# Altium project 省电V1.0.PrjPCB
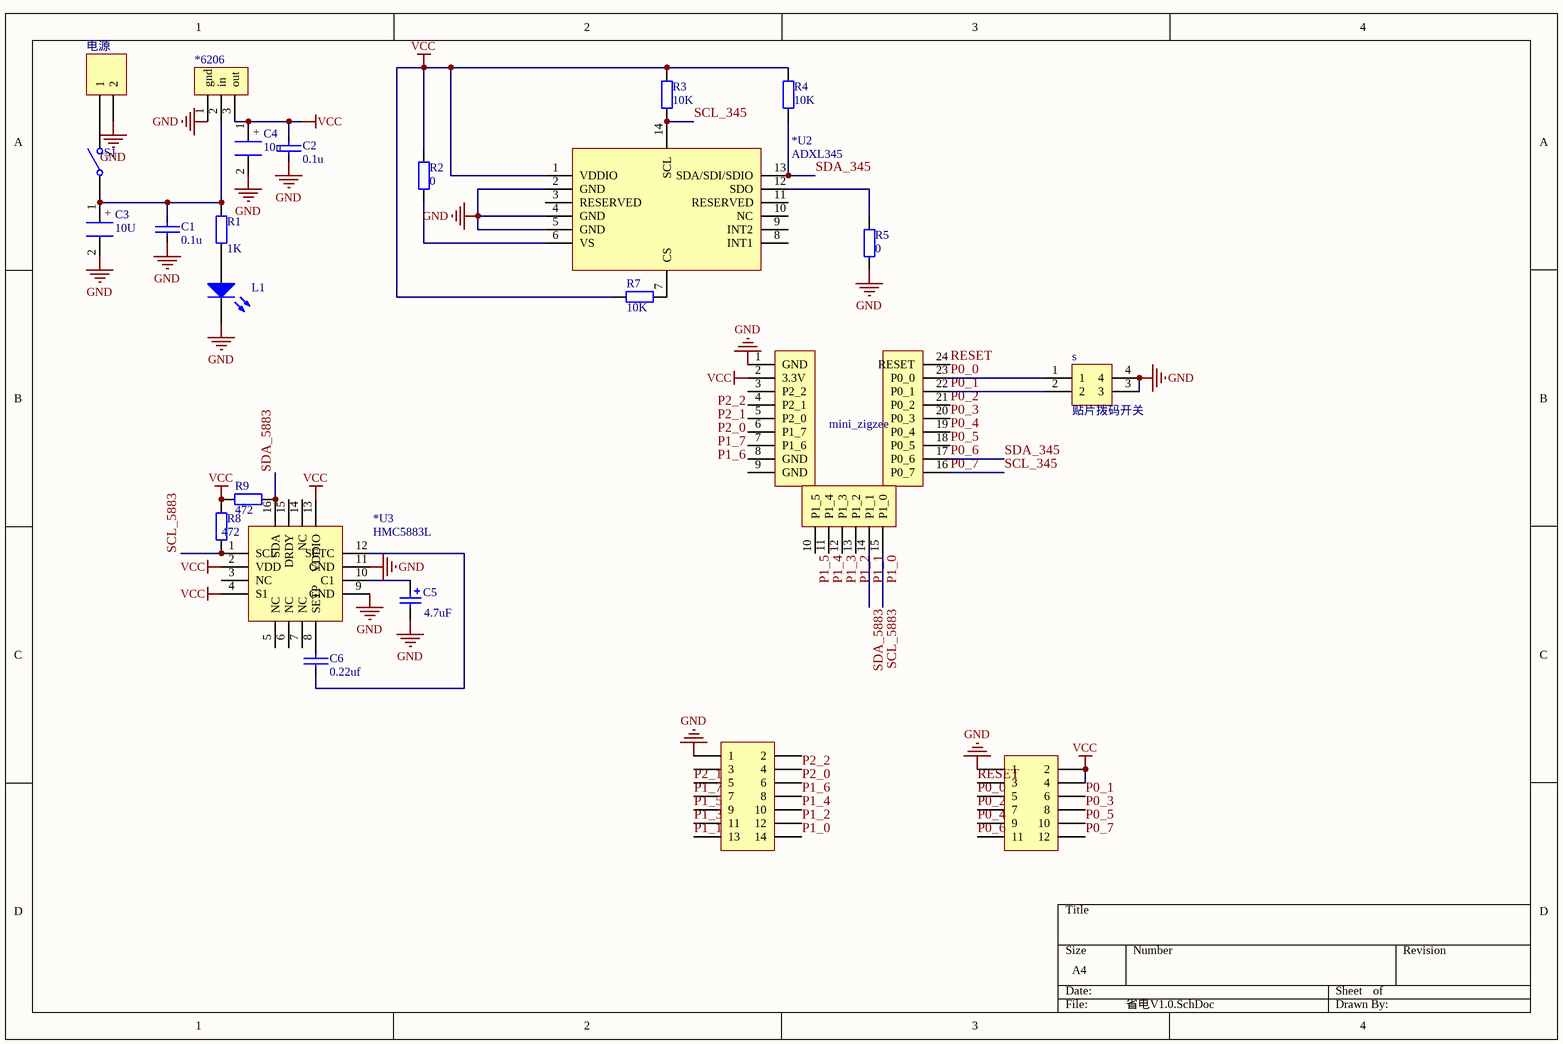
[diagram p0: 省电V1.0.SchDoc]
1 sheet, 24 parts. Net scope: global (net labels, ports and power ports of the same name join across sheets).
Board file: 省电v1.0.PcbDoc

## Sheet 省电V1.0.SchDoc
size A4

### Parts
*U1  *6206  [SOT89/X.7]
*U2  ADXL345  [ADXL345]
*U3  HMC5883L  [HMC5883L]
*U4  mini_zigzee  [mini_zigbee]
C1  0.1u  [0603]
C2  0.1u  [0603]
C3  10U  [1206]
C4  10u  [1206]
C5  value 4.7uF  [0603]  (hidden comment: Cap Pol2)
C6  0.22uf  [0603]
JP2  Header 2X7  [HDR2-7]  (value not drawn)
JP3  Header 2X6  [HDR2-6]  (value not drawn)
L1  LED-3MM  [0603]  (value not drawn)
R1  value 1K  [0603]  (hidden comment: Res)
R2  value 0  [0603]  (hidden comment: Res)
R3  value 10K  [0603]  (hidden comment: Res)
R4  value 10K  [0603]  (hidden comment: Res)
R5  value 0  [0603]  (hidden comment: Res)
R7  value 10K  [0603]  (hidden comment: Res)
R8  value 472  [0603]  (hidden comment: Res)
R9  value 472  [0603]  (hidden comment: Res)
s  贴片拨码开关  [贴片拨码开关]
S1  (no value)  [手电筒开关]
电源  Header 2  [2032纽扣底座]  (value not drawn)

### Nets
GND: *U1.1(gnd) *U2.2(GND) *U2.4(GND) *U2.5(GND) *U3.9(GND) *U3.11(GND) *U4.1(GND) C1.2 C2.2 C3.2 C4.2 C5.2 JP2.1 JP3.1 L1.2(K) R5.1 s.3 s.4 电源.2
VCC: *U1.3(out) *U2.1(VDDIO) *U3.2(VDD) *U3.4(S1) *U3.13(VDDIO) *U4.2(3.3V) C2.1 C4.1 JP3.2 JP3.4 R2.2 R3.2 R4.2 R7.2 R8.2 R9.2
P0_0: *U4.23(P0_0) JP3.5 s.1
P0_1: *U4.22(P0_1) JP3.6 s.2
P0_2: *U4.21(P0_2) JP3.7
P0_3: *U4.20(P0_3) JP3.8
P0_4: *U4.19(P0_4) JP3.9
P0_5: *U4.18(P0_5) JP3.10
P0_6: *U2.13(SDA/SDI/SDIO) *U4.17(P0_6) JP3.11 R4.1  [also labelled SDA_345]
P0_7: *U2.14(SCL) *U4.16(P0_7) JP3.12 R3.1  [also labelled SCL_345]
P1_0: *U3.1(SCL) *U4.15(P1_0) JP2.14 R8.1  [also labelled SCL_5883]
P1_1: *U3.16(SDA) *U4.14(P1_1) JP2.13 R9.1  [also labelled SDA_5883]
P1_2: *U4.13(P1_2) JP2.12
P1_3: *U4.12(P1_3) JP2.11
P1_4: *U4.11(P1_4) JP2.10
P1_5: *U4.10(P1_5) JP2.9
P1_6: *U4.7(P1_6) JP2.8
P1_7: *U4.6(P1_7) JP2.7
P2_0: *U4.5(P2_0) JP2.6
P2_1: *U4.4(P2_1) JP2.5
P2_2: *U4.3(P2_2) JP2.4
RESET: *U4.24(RESET) JP3.3
Net*U1_2: *U1.2(in) C1.1 C3.1 R1.2 S1.1(COMMON)
Net*U2_6: *U2.6(VS) R2.1
Net*U2_7: *U2.7(CS) R7.1
Net*U2_12: *U2.12(SDO) R5.2
Net*U3_8: *U3.8(SETP) C6.1
Net*U3_10: *U3.10(C1) C5.1
Net*U3_12: *U3.12(SETC) C6.2
NetL1_1: L1.1(A) R1.1
NetS1_2: S1.2(NO) 电源.1

Not connected (* = marked no-connect by the designer): *U2 3(RESERVED) 8(INT1) 9(INT2) 10(NC) 11(RESERVED); *U3 3(NC) 5(NC) 6(NC) 7(NC) 14(NC) 15(DRDY); *U4 8(GND) 9(GND); JP2 2 3

### Notes on the sheet
- (in symbol CAP-10U-T) +

### Library data of the parts
*U1 = 6206A
C1 C2 C6 = CAP
C3 C4 = CAP-10U-T
C5 = Cap Pol2: Polarized Capacitor (Axial); Manufacturer: Generic Components; Class: Passive; Published: 08/06/2000; Publisher: Altium Hobart Technology Centre; SubClass: Capacitor
JP2 = Header 2X7: Header, 7-Pin, Dual row; Manufacturer: Generic Components; Class: Connector
JP3 = Header 2X6: Header, 6-Pin, Dual row; Manufacturer: Generic Components; Class: Connector
R1-R5 R7-R9 = Res: Resistor; Manufacturer: Generic Components; Class: Passive; Published: 08/06/2000; Publisher: Altium Hobart Technology Centre; SubClass: Resistor
S1 = SW-SPST: Single-Pole, Single-Throw Switch; Manufacturer: Generic Components; Published: 1999
电源 = Header 2: Header, 2-Pin; Revision: 17-Jul-2002: Re-released for DXP Platform.; Publisher: Altium Limited